# EAGLE design CrowPanel ESP32 Display-1.54(E) Inch(1) (EAGLE 9.6.2)
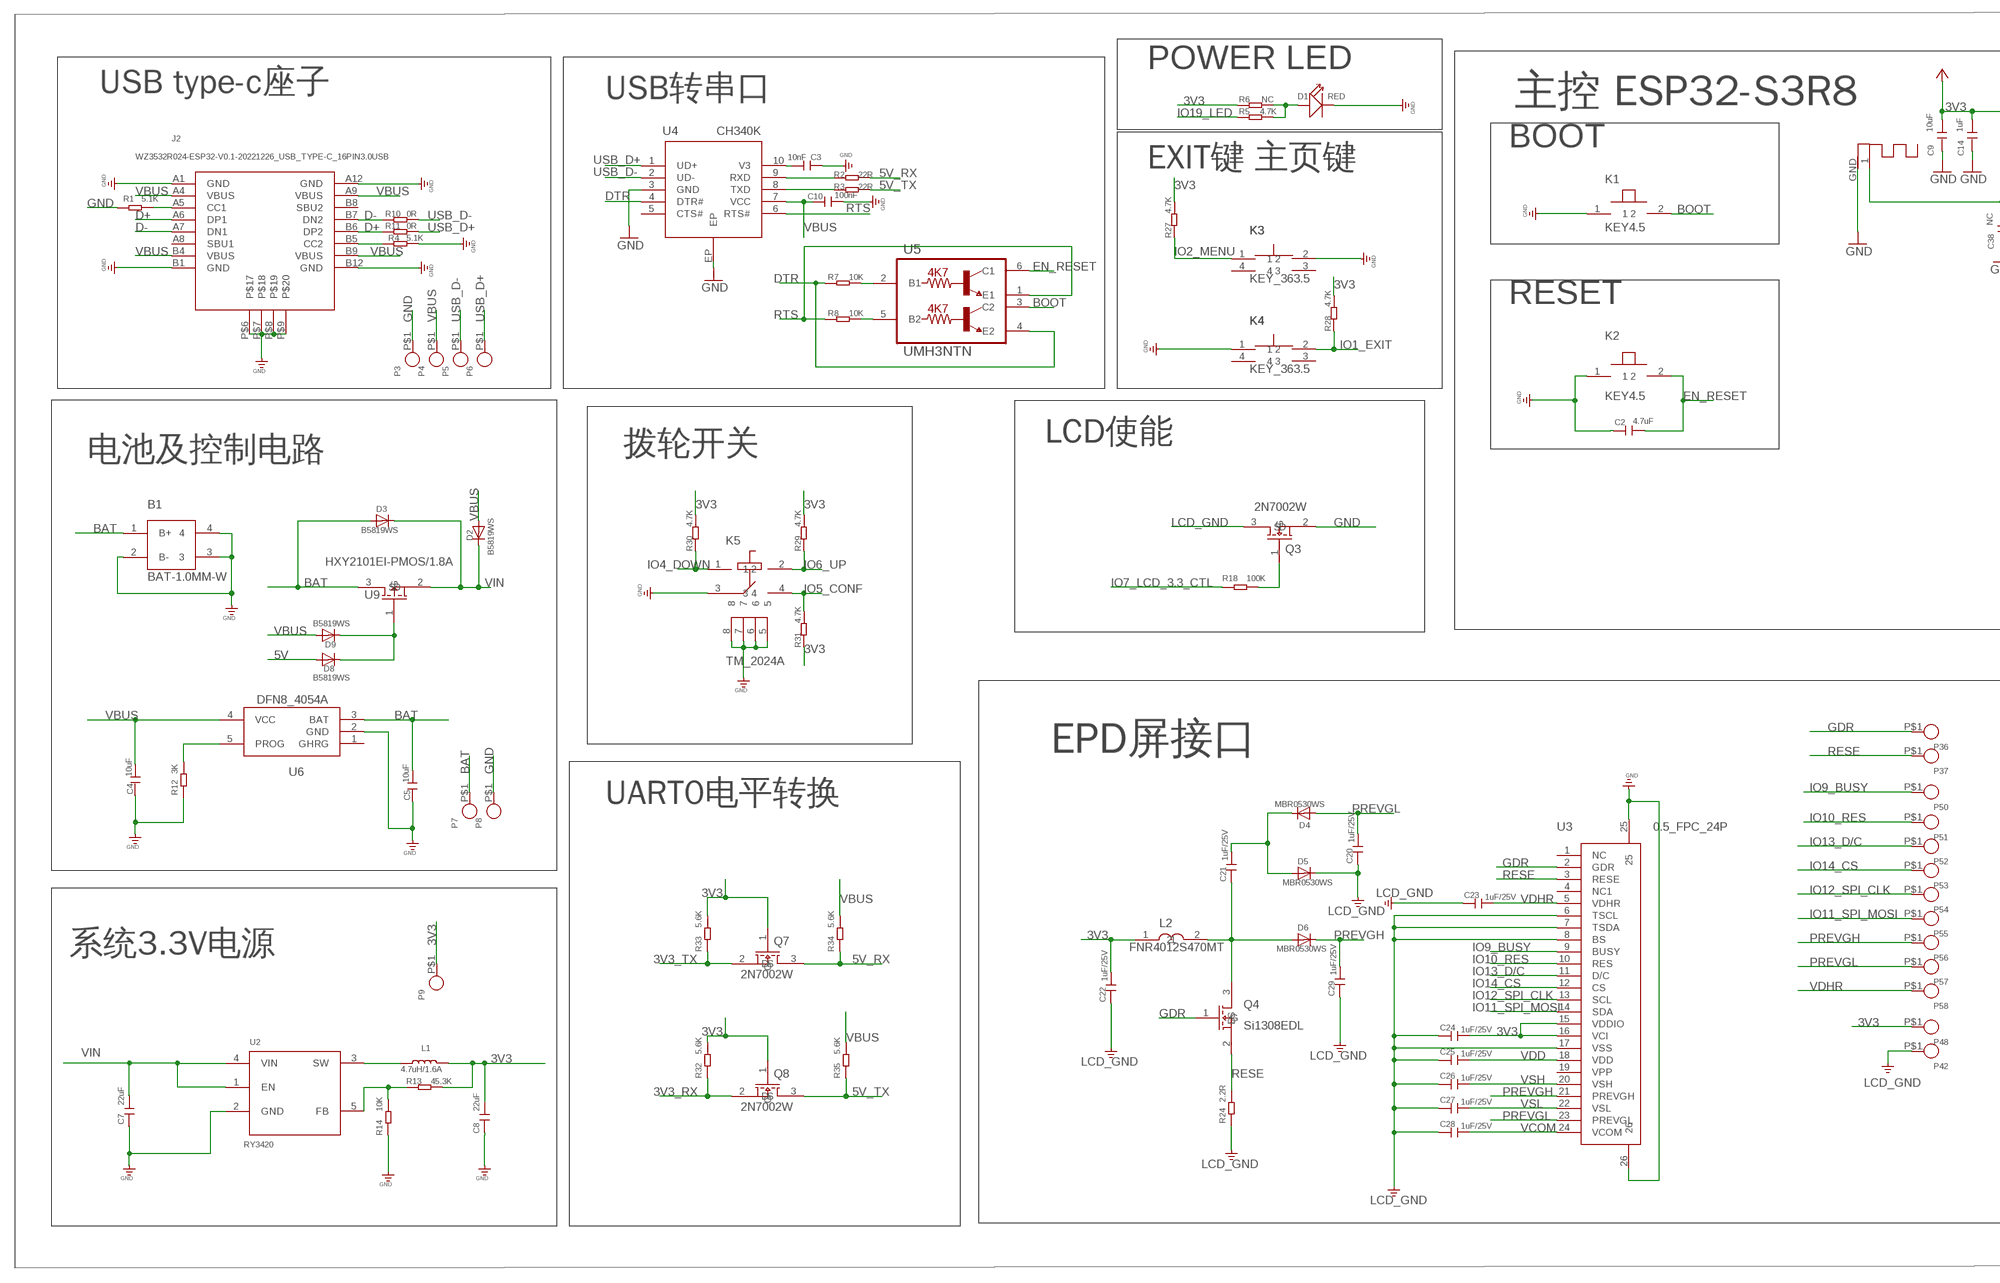
[diagram p0: schematic, sheet 1, part 1 of 2]
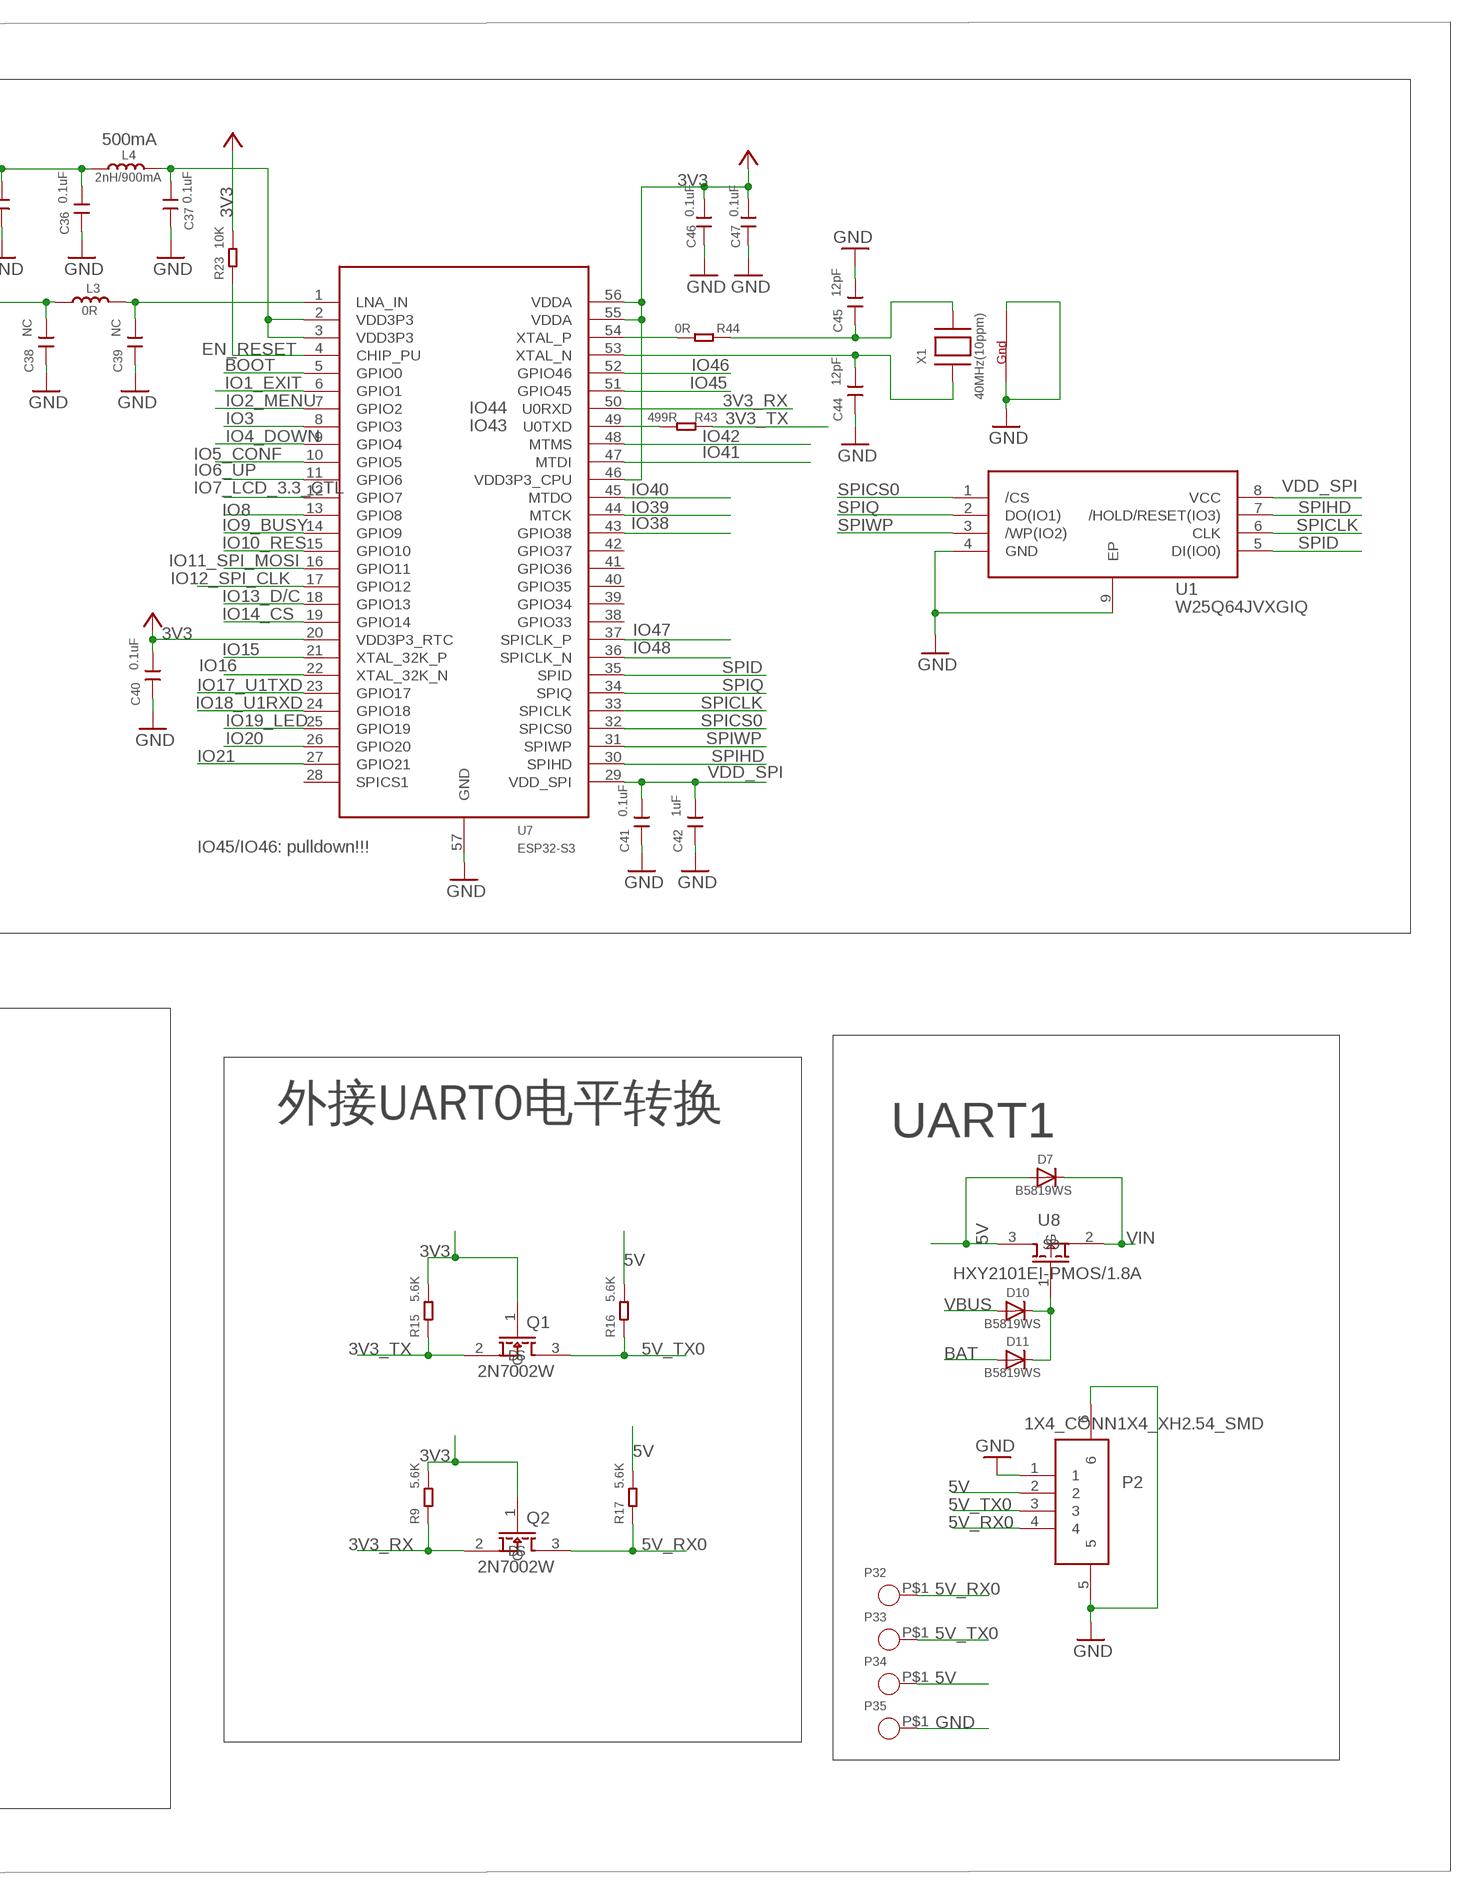
[diagram p1: schematic, sheet 1, part 2 of 2]

## Parts
ANT1  ADAFRUIT_ANTENNA  [ADAFRUIT_RN-ANT]
B1  BAT-1.0MM-W  [SH1.0MM-W]
C2  4.7uF  C0402_W  [0402]
C3  10nF  C0402_W  [0402]
C4  10uF  C0402_W  [0402]
C5  10uF  C0402_W  [0402]
C7  22uF  C0603  [0603]
C8  22uF  C0603  [0603]
C9  10uF  C0402_W  [0402]
C10  100nF  C0402_W  [0402]
C14  1uF  C0402_W  [0402]
C20  1uF/25V  C0402_W  [0402]
C21  1uF/25V  C0402_W  [0402]
C22  1uF/25V  C0402_W  [0402]
C23  1uF/25V  C0402_W  [0402]
C24  1uF/25V  C0402_W  [0402]
C25  1uF/25V  C0402_W  [0402]
C26  1uF/25V  C0402_W  [0402]
C27  1uF/25V  C0402_W  [0402]
C28  1uF/25V  C0402_W  [0402]
C29  1uF/25V  C0402_W  [0402]
C36  0.1uF  C0402_W  [0402]
C37  0.1uF  C0402_W  [0402]
C38  NC  C0402_W  [0402]
C39  NC  C0402_W  [0402]
C40  0.1uF  C0402_W  [0402]
C41  0.1uF  C0402_W  [0402]
C42  1uF  C0402_W  [0402]
C44  12pF  C0402_W  [0402]
C45  12pF  C0402_W  [0402]
C46  0.1uF  C0402_W  [0402]
C47  0.1uF  C0402_W  [0402]
D1  RED  A_XBJ_DISCRETE_LED0603  [A_XBJ_DISCRETE_LED-0603]
D2  B5819WS  [DISCRETE_SOD323]
D3  B5819WS  [DISCRETE_SOD323]
D4  MBR0530WS  B5819WS  [DISCRETE_SOD323]
D5  MBR0530WS  B5819WS  [DISCRETE_SOD323]
D6  MBR0530WS  B5819WS  [DISCRETE_SOD323]
D7  B5819WS  [DISCRETE_SOD323]
D8  B5819WS  [DISCRETE_SOD323]
D9  B5819WS  [DISCRETE_SOD323]
D10  B5819WS  [DISCRETE_SOD323]
D11  B5819WS  [DISCRETE_SOD323]
J2  WZ3532R024-ESP32-V0.1-20221226_USB_TYPE-C_16PIN3.0USB  [WZ3532R024-ESP32-V0.1-20221226_KEVIN_3.0TYPEC-SMD]
K1  KEY4.5  [KEY-4.5]
K2  KEY4.5  [KEY-4.5]
K3  KEY_363.5  [KEY_3*6*3.5]
K4  KEY_363.5  [KEY_3*6*3.5]
K5  TM_2024A  [TM_2024A]
L1  4.7uH/1.6A  A9G_DISCRETE_L0805  [A9G_DISCRETE_L0805]
L2  FNR4012S470MT  [FNR4012S470MT]
L3  0R  L0402  [L0402]
L4  2nH/900mA  L0402  [L0402]
P2  1X4_CONN1X4_XH2.54_SMD  [CONN-SMD-4P-P2.54]
P3  CROWPI_POW_PADPAD-1.0MM  [CROWPI_POW_PAD-1.0MM]
P4  CROWPI_POW_PADPAD-1.0MM  [CROWPI_POW_PAD-1.0MM]
P5  CROWPI_POW_PADPAD-1.0MM  [CROWPI_POW_PAD-1.0MM]
P6  CROWPI_POW_PADPAD-1.0MM  [CROWPI_POW_PAD-1.0MM]
P7  CROWPI_POW_PADPAD-1.0MM  [CROWPI_POW_PAD-1.0MM]
P8  CROWPI_POW_PADPAD-1.0MM  [CROWPI_POW_PAD-1.0MM]
P9  CROWPI_POW_PADPAD-1.0MM  [CROWPI_POW_PAD-1.0MM]
P32  CROWPI_POW_PADPAD-1.0MM  [CROWPI_POW_PAD-1.0MM]
P33  CROWPI_POW_PADPAD-1.0MM  [CROWPI_POW_PAD-1.0MM]
P34  CROWPI_POW_PADPAD-1.0MM  [CROWPI_POW_PAD-1.0MM]
P35  CROWPI_POW_PADPAD-1.0MM  [CROWPI_POW_PAD-1.0MM]
P36  CROWPI_POW_PADPAD-1.0MM  [CROWPI_POW_PAD-1.0MM]
P37  CROWPI_POW_PADPAD-1.0MM  [CROWPI_POW_PAD-1.0MM]
P42  CROWPI_POW_PADPAD-1.0MM  [CROWPI_POW_PAD-1.0MM]
P48  CROWPI_POW_PADPAD-1.0MM  [CROWPI_POW_PAD-1.0MM]
P50  CROWPI_POW_PADPAD-1.0MM  [CROWPI_POW_PAD-1.0MM]
P51  CROWPI_POW_PADPAD-1.0MM  [CROWPI_POW_PAD-1.0MM]
P52  CROWPI_POW_PADPAD-1.0MM  [CROWPI_POW_PAD-1.0MM]
P53  CROWPI_POW_PADPAD-1.0MM  [CROWPI_POW_PAD-1.0MM]
P54  CROWPI_POW_PADPAD-1.0MM  [CROWPI_POW_PAD-1.0MM]
P55  CROWPI_POW_PADPAD-1.0MM  [CROWPI_POW_PAD-1.0MM]
P56  CROWPI_POW_PADPAD-1.0MM  [CROWPI_POW_PAD-1.0MM]
P57  CROWPI_POW_PADPAD-1.0MM  [CROWPI_POW_PAD-1.0MM]
P58  CROWPI_POW_PADPAD-1.0MM  [CROWPI_POW_PAD-1.0MM]
Q1  2N7002W  [SOT-323_W]
Q2  2N7002W  [SOT-323_W]
Q3  2N7002W  [SOT-323_W]
Q4  Si1308EDL  HXY2102EI  [SOT-323_W]
Q7  2N7002W  [SOT-323_W]
Q8  2N7002W  [SOT-323_W]
R1  5.1K  R0402-1  [0402]
R2  22R  R0402-1  [0402]
R3  22R  R0402-1  [0402]
R4  5.1K  R0402-1  [0402]
R5  4.7K  R0402-1  [0402]
R6  NC  R0402-1  [0402]
R7  10K  R0402-1  [0402]
R8  10K  R0402-1  [0402]
R9  5.6K  R0402-1  [0402]
R10  0R  R0402-1  [0402]
R11  0R  R0402-1  [0402]
R12  3K  R0402-1  [0402]
R13  45.3K  R0402-1  [0402]
R14  10K  R0402-1  [0402]
R15  5.6K  R0402-1  [0402]
R16  5.6K  R0402-1  [0402]
R17  5.6K  R0402-1  [0402]
R18  100K  R0402-1  [0402]
R23  10K  R0402-1  [0402]
R24  2.2R  R0402-1  [0402]
R27  4.7K  R0402-1  [0402]
R28  4.7K  R0402-1  [0402]
R29  4.7K  R0402-1  [0402]
R30  4.7K  R0402-1  [0402]
R31  4.7K  R0402-1  [0402]
R32  5.6K  R0402-1  [0402]
R33  5.6K  R0402-1  [0402]
R34  5.6K  R0402-1  [0402]
R35  5.6K  R0402-1  [0402]
R43  499R  R0402-1  [0402]
R44  0R  R0402-1  [0402]
U1  W25Q64JVXGIQ  [XSON-EP(4×4)]
U2  RY3420  CROWBOT_-V1.0-20220525_A_XBJ_HM3420B  [CROWBOT_-V1.0-20220525_A_XBJ_SOT23-5]
U3  0.5_FPC_24P  [0.5_FPC_24P]
U4  CH340K  [ESOP-10-EP-150MIL]
U5  UMH3NTN  [SOP65P210X100-6N]
U6  DFN8_4054A  [DFN8_SOP23-5]
U7  ESP32-S3  [QFN56-7*7MM]
U8  HXY2101EI-PMOS/1.8A  HXY2101EI-PMOS  [SOT-323_W]
U9  HXY2101EI-PMOS/1.8A  HXY2101EI-PMOS  [SOT-323_W]
X1  40MHz(10ppm)  ADAFRUIT_XTAL-4-3225  [ADAFRUIT_NX3225]

## Nets
3V3: C8.2 C9.2 C14.2 C22.1 C24.1 C36.2 C40.2 C46.2 C47.2 L1.2 L2.1 L4.1 P9.P$1 P48.P$1 Q1.1(G) Q2.1(G) Q7.1(G) Q8.1(G) R6.2 R9.2 R13.2 R15.2 R23.2 R27.2 R28.2 R29.2 R30.2 R31.1 R32.2 R33.2 U3.15(VDDIO) U3.16(VCI) U7.20(VDD3P3_RTC) U7.46(VDD3P3_CPU) U7.55(VDDA) U7.56(VDDA) ; supply symbol labelled +3V3
3V3_RX: Q2.2(S) Q8.2(S) R9.1 R32.1 U7.50(U0RXD)
3V3_TX: Q1.2(S) Q7.2(S) R15.1 R33.1 R43.1
5V: D7.+(A) D8.+(A) P2.2 P34.P$1 R16.2 R17.2 U8.3(D)
5V_RX: Q7.3(D) R2.2 R34.1
5V_RX0: P2.4 P32.P$1 Q2.3(D) R17.1
5V_TX: Q8.3(D) R3.2 R35.1
5V_TX0: P2.3 P33.P$1 Q1.3(D) R16.1
BAT: B1.1(B+) C5.2 D3.+(A) D11.+(A) P7.P$1 U6.3(BAT) U9.3(D)
BOOT: K1.2 U5.3(C2) U7.5(GPIO0)
D+: J2.A6(DP1) J2.B6(DP2) R11.1
D-: J2.A7(DN1) J2.B7(DN2) R10.1
DTR: R7.1 U4.4(DTR#) U5.4(E2)
EN_RESET: C2.2 K2.2 R23.1 U5.6(C1) U7.4(CHIP_PU)
GDR: P36.P$1 Q4.1(G) U3.2(GDR)
GND: ANT1.GND B1.2(B-) B1.3 B1.4 C2.1 C3.1 C4.1 C5.1 C7.1 C8.1 C9.1 C10.2 C14.1 C36.1 C37.1 C38.1 C39.1 C40.1 C41.1 C42.1 C44.1 C45.2 C46.1 C47.1 D1.- J2.A1(GND) J2.A12(GND) J2.B1(GND) J2.B12(GND) J2.P$6 J2.P$7 J2.P$8 J2.P$9 K1.1 K2.1 K3.2 K4.1 K5.3 K5.5 K5.6 K5.7 K5.8 P2.1 P2.5 P2.6 P3.P$1 P8.P$1 P35.P$1 Q3.2(S) R1.1 R4.2 R12.1 R14.1 U1.4(GND) U1.9(EP) U2.2(GND) U3.25 U3.26 U4.3(GND) U4.EP U6.2(GND) U7.57(GND) X1.2(G2) X1.4(G1)
IO1_EXIT: K4.2 R28.1 U7.6(GPIO1)
IO2_MENU: K3.1 R27.1 U7.7(GPIO2)
IO3: U7.8(GPIO3)
IO4_DOWN: K5.1 R30.1 U7.9(GPIO4)
IO5_CONF: K5.4 R31.2 U7.10(GPIO5)
IO6_UP: K5.2 R29.1 U7.11(GPIO6)
IO7_LCD_3.3_CTL: R18.1 U7.12(GPIO7)
IO8: U7.13(GPIO8)
IO9_BUSY: P50.P$1 U3.9(BUSY) U7.14(GPIO9)
IO10_RES: P51.P$1 U3.10(RES) U7.15(GPIO10)
IO11_SPI_MOSI: P55.P$1 U3.14(SDA) U7.16(GPIO11)
IO12_SPI_CLK: P54.P$1 U3.13(SCL) U7.17(GPIO12)
IO13_D/C: P52.P$1 U3.11(D/C) U7.18(GPIO13)
IO14_CS: P53.P$1 U3.12(CS) U7.19(GPIO14)
IO15: U7.21(XTAL_32K_P)
IO16: U7.22(XTAL_32K_N)
IO17_U1TXD: U7.23(GPIO17)
IO18_U1RXD: U7.24(GPIO18)
IO19_LED: R5.2 U7.25(GPIO19)
IO20: U7.26(GPIO20)
IO21: U7.27(GPIO21)
IO38: U7.43(GPIO38)
IO39: U7.44(MTCK)
IO40: U7.45(MTDO)
IO41: U7.47(MTDI)
IO42: U7.48(MTMS)
IO45: U7.51(GPIO45)
IO46: U7.52(GPIO46)
IO47: U7.37(SPICLK_P)
IO48: U7.36(SPICLK_N)
LCD_GND: C20.2 C22.2 C23.2 C24.2 C25.2 C26.2 C27.2 C28.2 C29.2 D5.-(C) P42.P$1 Q3.3(D) R24.1 U3.6(TSCL) U3.7(TSDA) U3.8(BS) U3.17(VSS) ; supply symbol labelled GND
N$1: R7.2 U5.2(B1)
N$2: D10.-(C) D11.-(C) U8.1(G)
N$3: R8.2 U5.5(B2)
N$5: J2.A5(CC1) R1.2
N$6: D8.-(C) D9.-(C) U9.1(G)
N$7: Q3.1(G) R18.2
N$8: R3.1 U4.8(TXD)
N$9: R13.1 R14.2 U2.5(FB)
N$10: C3.2 U4.10(V3)
N$11: L1.1 U2.3(SW)
N$12: J2.B5(CC2) R4.1
N$16: R12.2 U6.5(PROG)
N$25: D1.+ R5.1 R6.1
N$30: ANT1.1(FEED) C38.2 L3.1
N$31: C39.2 L3.2 U7.1(LNA_IN)
N$33: C37.2 L4.2 U7.2(VDD3P3) U7.3(VDD3P3)
N$36: R2.1 U4.9(RXD)
N$37: R44.2 U7.54(XTAL_P)
N$55: C21.1 D4.-(C) D5.+(A)
N$56: C21.2 D6.+(A) L2.2 Q4.3(D)
N$63: R43.2 U7.49(U0TXD)
N$65: C44.2 U7.53(XTAL_N) X1.1(X1)
N$66: C45.1 R44.1 X1.3(X2)
PREVGH: C29.1 D6.-(C) P56.P$1 U3.21(PREVGH)
PREVGL: C20.1 D4.+(A) P57.P$1 U3.23(PREVGL)
RESE: P37.P$1 Q4.2(S) R24.2 U3.3(RESE)
RTS: R8.1 U4.6(RTS#) U5.1(E1)
SPICLK: U1.6(CLK) U7.33(SPICLK)
SPICS0: U1.1(/CS) U7.32(SPICS0)
SPID: U1.5(DI(IO0)) U7.35(SPID)
SPIHD: U1.7(/HOLD/RESET(IO3)) U7.30(SPIHD)
SPIQ: U1.2(DO(IO1)) U7.34(SPIQ)
SPIWP: U1.3(/WP(IO2)) U7.31(SPIWP)
USB_D+: P6.P$1 R11.2 U4.1(UD+)
USB_D-: P5.P$1 R10.2 U4.2(UD-)
VBUS: C4.2 C10.1 D2.+(A) D9.+(A) D10.+(A) J2.A4(VBUS) J2.A9(VBUS) J2.B4(VBUS) J2.B9(VBUS) P4.P$1 R34.2 R35.2 U4.7(VCC) U6.4(VCC)
VCOM: C28.1 U3.24(VCOM)
VDD: C25.1 U3.18(VDD)
VDD_SPI: C41.2 C42.2 U1.8(VCC) U7.29(VDD_SPI)
VDHR: C23.1 P58.P$1 U3.5(VDHR)
VIN: C7.2 D2.-(C) D3.-(C) D7.-(C) U2.1(EN) U2.4(VIN) U8.2(S) U9.2(S)
VSH: C26.1 U3.20(VSH)
VSL: C27.1 U3.22(VSL)
Unconnected: J2.A8(SBU1) J2.B8(SBU2) K3.3 K3.4 K4.3 K4.4 U3.1(NC) U3.4(NC1) U3.19(VPP) U4.5(CTS#) U6.1(GHRG) U7.28(SPICS1) U7.38(GPIO33) U7.39(GPIO34) U7.40(GPIO35) U7.41(GPIO36) U7.42(GPIO37)

## Notes on the sheet
- POWER LED
- USB type-c座子 | USB转串口 | 500mA
- 主控 ESP32-S3R8
- BOOT
- EXIT键 主页键
- IO44
- IO43
- RESET
- LCD使能
- 电池及控制电路 | 拨轮开关
- IO45/IO46: pulldown!!!
- EPD屏接口 | 外接UART0电平转换
- UART1
- UART0电平转换
- 系统3.3V电源

## Library data of the parts
ANT1 = ESP32-S3 4.2“ EINK V1.3:ADAFRUIT_ANTENNA
B1 = WGH:BAT-1.0MM-W
C2-C5 C9 C10 C14 C20-C29 C36-C42 C44-C47 = WGH:C0402_W
C7 C8 = WGH:C0603
D1 = CrowPanel ESP32 Display-4.3-inch-V2.1-20240314:A_XBJ_DISCRETE_LED*
D2-D11 = ESP32-S3 4.2“ EINK V1.3:B5819WS
J2 = CrowPanel ESP32 Display-4.3-inch-V2.1-20240314:WZ3532R024-ESP32-V0.1-20221226_USB_TYPE-C_16PIN
K1 K2 = WGH:KEY4.5
K3 K4 = WGH:KEY_3*6*3.5
K5 = WGH:TM_2024A
L1 = ESP32-S3 4.2“ EINK V1.3:A9G_DISCRETE_L*
L2 = WGH:FNR4012S470MT
L3 L4 = SX1302_Module:L*
P2 = Connecting_base:1X4_CONN
P3-P9 P32-P37 P42 P48 P50-P58 = ESP32 Terminal - 3.5 Inch_2.0:CROWPI_POW_PAD*
Q1-Q3 Q7 Q8 = WGH:2N7002W
Q4 = WGH:HXY2102EI
R1-R18 R23 R24 R27-R35 R43 R44 = WGH:R0402-1
U1 = ESP32-S3 4.2“ EINK V1.3:W25Q64JVXGIQ
U2 = CrowPanel ESP32 Display-4.3-inch-V2.1-20240314:CROWBOT_-V1.0-20220525_A_XBJ_HM3420B
U3 = ESP32 Terminal - 3.5 Inch_2.0:0.5_FPC_24P
U4 = sale:CH340K
U5 = UMH3NTN:UMH3NTN: Dual NPN BJT with 4.7K Base resistor Datasheet <https://fscdn.rohm.com/en/products/databook/datasheet/discrete/transistor/digital/umh3ntn-e.pdf> BUY NOW <https://www.digikey.ca/en/products/detail/rohm-semiconductor/umh3ntn/659279> Check availability <https://pricing.snapeda.com/parts/UMH3NTN/Rohm/view-part?ref=eda>; AVAILABILITY: In Stock; CHECK_PRICES: https://www.snapeda.com/parts/UMH3NTN/Rohm/view-part/?ref=eda; DESCRIPTION: Pre-Biased Bipolar Transistor (BJT) 2 NPN - Pre-Biased (Dual) 50V 100mA 250MHz 150mW Surface Mount UMT6; MF: Rohm; MP: UMH3NTN; PACKAGE: SOT-363 Rohm; PRICE: None; PURCHASE-URL: https://www.snapeda.com/api/url_track_click_mouser/?unipart_id=355768&manufacturer=Rohm&part_name=UMH3NTN&search_term=umh3n; SNAPEDA_LINK: https://www.snapeda.com/parts/UMH3NTN/Rohm/view-part/?ref=snap
U6 = CrowPanel ESP32 Display-4.3-inch-V2.1-20240314:DFN8_4054A
U7 = sale:ESP32-S3
U8 U9 = WGH:HXY2101EI-PMOS
X1 = ESP32-S3 4.2“ EINK V1.3:ADAFRUIT_XTAL-4: Classic 4-pin 3.2 x 2.5mm crystal

## Net classes
0 default: width 0.203 mm, drill 0.305 mm, clearance 0.152 mm

## Board
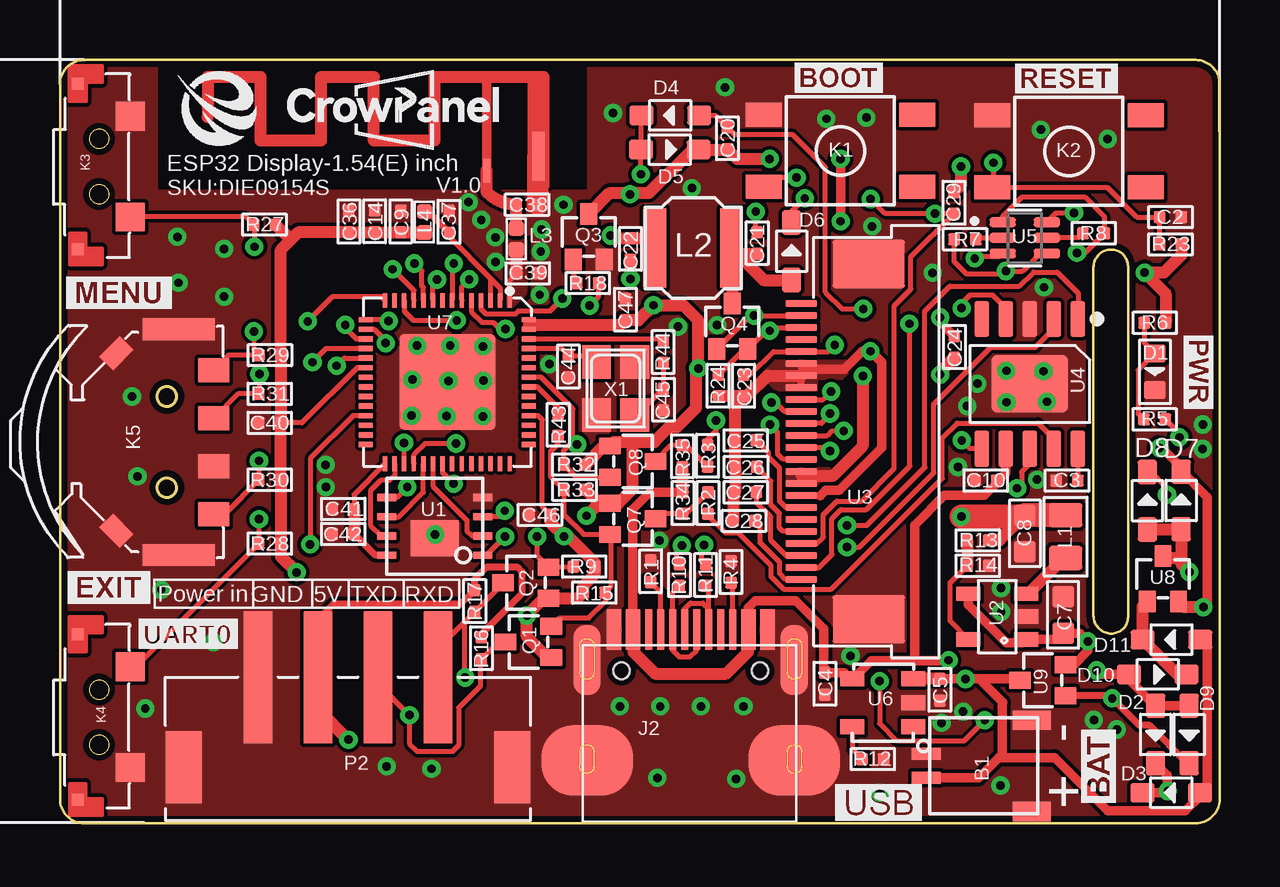
[diagram p2: board, top side]
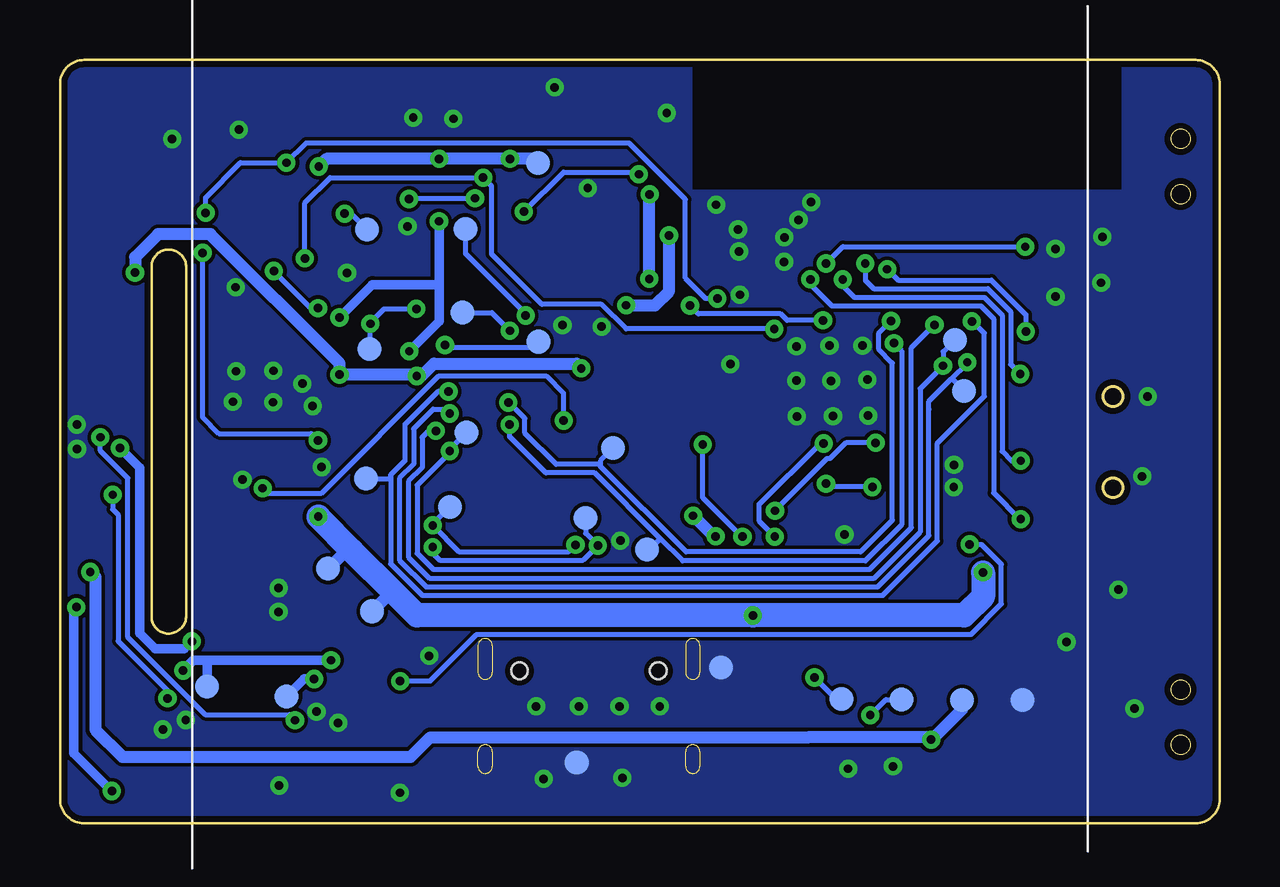
[diagram p3: board, bottom side, seen from below]

Size 48.32 x 31.8 mm. Coordinates in mm from the lower left corner, seen from the top.
Outline: 0,30.8 0,1 arc90 1,0 47.32,0 arc90 48.32,1 48.32,30.8 arc90 47.32,31.8 1,31.8 arc90 0,30.8
Outline: 43.81,7.9 arc90 44.5,8.59 44.5,23.2 arc90 43.8,23.9 arc90 43.06,23.16 43.06,8.65 arc90 43.81,7.9
Copper layers (1*16): Top 0.035mm / dielectric 1.5mm / Bottom 0.035mm
Design rules "default *": minimum track width 6mil, minimum drill 0.35mm, track to track 6mil, track to pad 6mil, pad to pad 6mil, via to via 6mil, smd to smd 6mil, copper to edge 10mil, drill to drill 6mil, minimum pad ring 10mil, minimum via ring 8mil, stop-mask expansion 4mil, vias tented up to drill 100mil, thermal gap 0mil
tRestrict: area 4.1,26.4 to 21.9,31.8
bRestrict: area 4.1,26.4 to 21.9,31.8

### Footprints (pad centres in the part's own frame; a part is rotated, then mirrored left to right if it is on the bottom)
ADAFRUIT_RN-ANT = smd 1 x 0.3: 1 0.5,2.159 | smd 2.032 x 0.508: GND 1.1,0
SH1.0MM-W = smd 0.5 x 1.2: 1 -0.5,2.4; 2 0.5,2.4 | smd 0.8 x 1.6: 3 -1.9,-2; 4 1.9,-2
0402 = smd 0.5 x 0.5: 1 -0.45,0; 2 0.45,0
0603 = smd 0.889 x 0.889: 1 -0.762,0; 2 0.762,0
A_XBJ_DISCRETE_LED-0603 = smd 0.762 x 0.889: + -0.762,0; - 0.762,0
DISCRETE_SOD323 = smd 1 x 0.8: + -1.2,0; - 1.2,0
WZ3532R024-ESP32-V0.1-20221226_KEVIN_3.0TYPEC-SMD = smd 0.3 x 1.7: A1 -3.35,0.5; A4 -2.55,0.5; A5 -1.25,0.5; A6 -0.25,0.5; A7 0.25,0.5; A8 1.25,0.5; A9 2.55,0.5; A12 3.35,0.5; B1 3.05,0.5; B4 2.25,0.5; B5 1.75,0.5; B6 0.75,0.5; B7 -0.75,0.5; B8 -1.75,0.5; B9 -2.25,0.5; B12 -3.05,0.5 | smd 1.143 x 2.921: P$6 -4.318,-0.762; P$7 4.318,-0.762 | smd 3.81 x 2.921: P$8 -4.318,-4.953; P$9 4.318,-4.953 | hole 0.68: -2.89,-1.22; 2.89,-1.22
KEY-4.5 = smd 1.5 x 1: 1 -3.2,1.5; 2 -3.2,-1.5; 3 3.2,-1.5; 4 3.2,1.5
KEY_3*6*3.5 = smd 1.2 x 1.2: 1 -2.1,-2.6; 2 2.1,-2.6 | smd 0.5 x 0.5: 3 3.45,-0.4; 4 -3.45,-0.4
TM_2024A = smd 1 x 1.3: 1 -3,0.65; 2 3,0.65; 3 -1,0.65; 4 1,0.65 | smd 0.9 x 3: 5 -4.7,2.1; 6 4.7,2.1 | smd 1.2 x 0.8 rotated 45: 7 -3.7,4.7 | smd 1.2 x 0.8 rotated 135: 8 3.7,4.7
A9G_DISCRETE_L0805 = smd 1.016 x 1.397: 1 -0.889,0; 2 0.889,0
FNR4012S470MT = smd 0.95 x 3.3: 1 -1.6,0; 2 1.6,0
L0402 = smd 0.635 x 0.635: 1 -0.445,0; 2 0.445,0
CONN-SMD-4P-P2.54 = smd 1.2 x 5.5: 1 -3.75,1.875; 2 -1.25,1.875; 3 1.25,1.875; 4 3.75,1.875 | smd 1.5 x 3: 5 6.85,-1.875; 6 -6.85,-1.875
CROWPI_POW_PAD-1.0MM = smd 1 x 1: P$1 0,0
SOT-323_W = smd 0.7 x 0.9: 1 -0.65,-0.95; 2 0.65,-0.95; 3 0,0.95
XSON-EP(4×4) = smd 0.8 x 0.3: 1 -2,1.2; 2 -2,0.4; 3 -2,-0.4; 4 -2,-1.2; 5 2,-1.2; 6 2,-0.4; 7 2,0.4; 8 2,1.2 | smd 2 x 1.5: 9 0,0.5
CROWBOT_-V1.0-20220525_A_XBJ_SOT23-5 = smd 0.6 x 1: 1 -0.95,-1.2; 2 0,-1.2; 3 0.95,-1.2; 4 0.95,1.2; 5 -0.95,1.2
0.5_FPC_24P = smd 1.3 x 0.3: 1 -2.54,5.75; 2 -2.54,5.25; 3 -2.54,4.75; 4 -2.54,4.25; 5 -2.54,3.75; 6 -2.54,3.25; 7 -2.54,2.75; 8 -2.54,2.25; 9 -2.54,1.75; 10 -2.54,1.25; 11 -2.54,0.75; 12 -2.54,0.25; 13 -2.54,-0.25; 14 -2.54,-0.75; 15 -2.54,-1.25; 16 -2.54,-1.75; 17 -2.54,-2.25; 18 -2.54,-2.75; 19 -2.54,-3.25; 20 -2.54,-3.75; 21 -2.54,-4.25; 22 -2.54,-4.75; 23 -2.54,-5.25; 24 -2.54,-5.75 | smd 3 x 2: 25 0.27,-7.4; 26 0.27,7.4
ESOP-10-EP-150MIL = smd 1.5 x 0.6: 1 -2.7,2; 2 -2.7,1; 3 -2.7,0; 4 -2.7,-1; 5 -2.7,-2; 6 2.7,-2; 7 2.7,-1; 8 2.7,0; 9 2.7,1; 10 2.7,2 | smd 2.4 x 3.2: EP 0,0
SOP65P210X100-6N = smd 1.09 x 0.4: 1 -0.92,0.65; 2 -0.92,0; 3 -0.92,-0.65; 4 0.92,-0.65; 5 0.92,0; 6 0.92,0.65
DFN8_SOP23-5 = smd 1 x 0.635: 1 -1.27,1; 2 -1.27,0; 3 -1.27,-1; 4 1.27,-1; 5 1.27,1
QFN56-7*7MM = smd 0.6 x 0.2: 1 -3.4,2.6; 2 -3.4,2.2; 3 -3.4,1.8; 4 -3.4,1.4; 5 -3.4,1; 6 -3.4,0.6; 7 -3.4,0.2; 8 -3.4,-0.2; 9 -3.4,-0.6; 10 -3.4,-1; 11 -3.4,-1.4; 12 -3.4,-1.8; 13 -3.4,-2.2; 14 -3.4,-2.6; 29 3.4,-2.6; 30 3.4,-2.2; 31 3.4,-1.8; 32 3.4,-1.4; 33 3.4,-1; 34 3.4,-0.6; 35 3.4,-0.2; 36 3.4,0.2; 37 3.4,0.6; 38 3.4,1; 39 3.4,1.4; 40 3.4,1.8; 41 3.4,2.2; 42 3.4,2.6 | smd 0.2 x 0.6: 15 -2.6,-3.4; 16 -2.2,-3.4; 17 -1.8,-3.4; 18 -1.4,-3.4; 19 -1,-3.4; 20 -0.6,-3.4; 21 -0.2,-3.4; 22 0.2,-3.4; 23 0.6,-3.4; 24 1,-3.4; 25 1.4,-3.4; 26 1.8,-3.4; 27 2.2,-3.4; 28 2.6,-3.4; 43 2.6,3.4; 44 2.2,3.4; 45 1.8,3.4; 46 1.4,3.4; 47 1,3.4; 48 0.6,3.4; 49 0.2,3.4; 50 -0.2,3.4; 51 -0.6,3.4; 52 -1,3.4; 53 -1.4,3.4; 54 -1.8,3.4; 55 -2.2,3.4; 56 -2.6,3.4 | smd 4 x 4: 57 0,0
ADAFRUIT_NX3225 = smd 1.4 x 1.2: 1 -1.1,-0.8; 2 1.1,-0.8; 3 1.1,0.8; 4 -1.1,0.8

### Placement (x,y rotation side)
ANT1  19.94,26.69 90 top
B1  38.49,2.39 90 top
C2  46.27,25.25 180 top
C3  41.96,14.28 0 top
C4  31.87,5.81 90 top
C5  36.66,5.56 90 top
C7  41.79,8.68 270 top
C8  40.2,12.08 90 top
C9  14.2,25.07 270 top
C10  38.58,14.28 180 top
C14  13.11,25.08 270 top
C20  27.81,28.54 270 top
C21  29.05,24.17 270 top
C22  23.77,23.93 270 top
C23  28.48,18.23 270 top
C24  37.27,19.84 90 top
C25  28.57,15.95 180 top
C26  28.58,14.85 180 top
C27  28.57,13.79 180 top
C28  28.5,12.6 180 top
C29  37.25,25.85 90 top
C36  12.04,25.07 270 top
C37  16.21,25.06 270 top
C38  19.46,25.77 180 top
C39  19.49,22.91 180 top
C40  8.74,16.68 0 top
C41  11.8,13.09 0 top
C42  11.8,12.05 0 top
C44  21.18,19.03 90 top
C45  25.14,17.65 270 top
C46  20,12.85 0 top
C47  23.56,21.4 270 top
D1  45.62,18.81 270 top
D2  45.65,3.7 270 top
D3  46.3,1.27 180 top
D4  25.43,29.49 180 top
D5  25.41,28.07 0 top
D6  30.48,23.83 90 top
D7  46.71,13.45 90 top
D8  45.31,13.44 90 top
D9  47.05,3.7 270 top
D10  45.74,6.2 0 top
D11  46.31,7.65 180 top
J2  26.28,7.57 0 top
K1  32.52,28.01 0 top
K2  42.04,27.99 0 top
K3  KEY_36*3.5  [KEY_3*6*3.5]  0.33,27.36 90 top
K4  KEY_36*3.5  [KEY_3*6*3.5]  0.33,4.42 90 top
K5  7.05,15.88 90 top
L1  41.9,11.94 90 top
L2  26.38,23.97 0 top
L3  19.01,24.34 270 top
L4  15.18,25.05 90 top
P2  12,4.21 0 top
P3  20.77,6.48 0 bottom
P4  42.19,5.69 0 bottom
P5  26.42,12.73 0 bottom
P6  32.08,13.18 0 bottom
P7  38.88,5.28 0 bottom
P8  26.79,2.52 0 bottom
P9  37.15,10.61 0 bottom
P32  15.76,5.17 0 bottom
P33  13.26,5.15 0 bottom
P34  10.73,5.13 0 bottom
P35  8.22,5.13 0 bottom
P36  31.43,24.77 0 bottom
P37  31.56,21.28 0 bottom
P42  28.41,27.52 0 bottom
P48  35.32,8.83 0 bottom
P50  35.57,14.36 0 bottom
P51  25.28,15.63 0 bottom
P52  10.65,18.01 0 bottom
P53  11.03,20.14 0 bottom
P54  31.38,16.28 0 bottom
P55  23.87,11.4 0 bottom
P56  35.53,24.74 0 bottom
P57  35.41,19.75 0 bottom
P58  28.39,20.06 0 bottom
Q1  19.52,7.55 90 top
Q2  19.41,10.02 90 top
Q3  22.03,24.43 0 top
Q4  28.01,20.7 0 top
Q7  23.87,12.68 270 top
Q8  23.87,15.07 270 top
R1  24.61,10.5 270 top
R2  27,13.34 90 top
R3  26.98,15.31 270 top
R4  27.96,10.47 90 top
R5  45.61,16.83 0 top
R6  45.62,20.85 0 top
R7  37.71,24.33 0 top
R8  43.07,24.58 180 top
R9  21.84,10.69 0 top
R10  25.81,10.34 90 top
R11  26.9,10.34 90 top
R12  33.87,2.67 180 top
R13  38.24,11.78 0 top
R14  38.24,10.73 180 top
R15  22.26,9.61 180 top
R16  17.56,7.29 90 top
R17  17.28,9.26 90 top
R18  21.99,22.5 180 top
R23  46.27,24.12 0 top
R24  27.42,18.23 90 top
R27  8.52,24.94 0 top
R28  8.74,11.65 0 top
R29  8.75,19.5 0 top
R30  8.74,14.31 0 top
R31  8.74,17.89 180 top
R32  21.43,14.94 0 top
R33  21.44,13.89 0 top
R34  25.95,13.34 90 top
R35  25.93,15.29 270 top
R43  20.76,16.6 90 top
R44  25.13,19.63 90 top
U1  15.61,12.37 180 top
U2  39.05,8.61 90 top
U3  33.43,15.9 0 top
U4  40.41,18.3 270 top
U5  40.2,24.39 0 top
U6  34.28,5.02 180 top
U7  16.14,18.38 270 top
U8  45.96,10.18 0 top
U9  40.95,5.96 90 top
U$6  [LOGO-MIN]  10.46,28.21 0 top
X1  23.15,18.11 270 top

### Tracks (layer width: path | path; a pad name or v marks a point on that pad's centre or on a via)
3V3  (via drill 0.35)
  Top 0.203: 19.54,20.75 U7.55 U7.56 | U3.15 30.89,14.63 30.89,14.48 U3.16 | U7.20 12.38,18.98 10.08,16.68 C40.2 | U7.46 19.92,16.98 20.1,16.8 20.1,13.18 20.43,12.85 C46.2 | v21,11.95 21.18,11.95
  Top 0.5: C8.2 39.14,11.78 R13.2 | v9.86,10.45 9.2,11.11 R28.2 R30.2 C40.2 R31.1 R29.2 9.2,23.89 9.61,24.3 | 9.61,24.3 R27.2 | 9.61,24.3 9.93,24.62 C36.2 C14.2 C9.2 14.88,24.62 14.93,24.57 15.14,24.57 L4.1 | 22.46,13.33 v21.94,12.81 | 22.46,13.33 Q7.1 23.27,13.33 23.87,13.93 23.87,15.89 | 22.46,13.33 R33.2 | 19.54,20.75 23.36,20.75 C47.2 24.1,20.95 v24.73,21.58 25.97,21.58 26.58,20.97 26.58,18.97 v26.6,18.95 26.49,18.84 26.49,17.3 25.71,16.52 25.39,16.52 24.76,15.89 23.87,15.89 | v22.94,24.48 23.05,24.38 C22.1 24.37,24.38 L2.1 | R6.2 46.07,22.06 v45.19,22.94 45.99,22.94 46.72,23.67 R23.2 | R32.2 22.66,15.72 Q8.1 23.09,15.89 23.87,15.89 | v33.45,18.64 33.45,18.62 33.45,15.71 32.22,14.48 30.89,14.48 | v36.67,18.69 36.67,18.79 C24.1 | 21.18,11.95 22.29,10.84 R9.2 22.28,10.37 21.81,9.9 R15.2 21.57,9.37 Q2.1 20.16,9.37 v19.45,8.66 19.45,7.77 20.32,6.9 Q1.1 | v21,11.95 20.45,12.5 C46.2
  Top 1: L1.2 40.21,12.83 C8.2 40.13,12.78 v37.56,12.78
  Bottom 0.5: v21,11.95 21.08,11.95 v21.94,12.81 | v24.73,21.58 23.53,21.58 22.94,22.17 v22.94,24.48 | v45.19,22.94 45.19,23.59 44.23,24.55 42.05,24.55 36.67,19.16 v36.67,18.69 33.51,18.69 v33.45,18.64 33.25,18.64 32.74,19.14 26.8,19.14 v26.6,18.95 | P9.P$1 36.4,11.36 36.16,11.36 | P48.P$1 34.48,9.67 34.46,9.67
  Bottom 1: v9.86,10.45 9.86,9.44 10.65,8.66 v19.45,8.66 33.45,8.66 34.46,9.67 36.16,11.36 37.56,12.76 v37.56,12.78
  pour Top: 30.25,14.8 30.25,14.05 31.5,14.05 31.7,14.25 32.26,14.25 32.43,14.42 32.06,14.79 31.41,14.79 30.26,14.79
3V3_RX  (via drill 0.35)
  Top 0.203: Q8.2 21.5,14.42 R32.1 20.98,15.53 21.37,15.92 | U7.50 20.06,18.57 21.37,17.26 21.37,15.92 | R9.1 21.37,10.67 Q2.2 19.88,11.15 v19.88,11.94 | v21.54,15.78 21.52,15.78 21.37,15.92
  Bottom 0.203: v19.88,11.94 19.92,11.94 21.54,13.56 v21.54,15.78
3V3_TX
  Top 0.203: R43.1 20.76,15.81 20.46,15.51 20.46,14.42 R33.1 20.99,12.86 21.82,12.03 Q7.2 22.94,12.01 22.94,9.84 R15.1 | Q1.2 20.83,8.56 22.04,8.56 22.71,9.23 R15.1 | R15.1
5V  (via drill 0.35)
  Top 0.3: P2.2 10.75,8.5 11.4,9.15 16.13,9.15 16.14,9.14 16.71,9.14 R17.2 17.28,10.18 17.78,10.68 19.05,10.68 19.24,10.48 19.24,9.56 17.56,7.88 R16.2
  Top 0.5: D8.+ 46.7,12.24 D7.+ 46.73,12.23 46.73,11.07 | v12.02,3.48 10.75,4.75 P2.2 | 46.73,11.07 46.02,11.07 U8.3 | v47.06,10.46 46.73,10.79 46.73,11.07
  Bottom 0.203: 17.16,3.58 17.24,3.58
  Bottom 0.5: 17.24,3.58 32.89,3.58 33.71,2.76 45.71,2.76 46.85,3.9 46.85,10.26 v47.06,10.46 | 12.12,3.58 17.16,3.58 | 12.12,3.58 11.9,3.58 10.73,4.75 P34.P$1 | 12.12,3.58 v12.02,3.48
5V_RX
  Top 0.203: R2.2 26.1,12.89 R34.1 25.03,12.89 Q7.3
5V_RX0  (via drill 0.35)
  Top 0.203: Q2.3 18.46,9.99 R17.1 16.86,8.38 | v16.88,6.07 16.86,6.09 16.86,8.38 | 16.86,8.38 15.75,7.28 P2.4
  Bottom 0.203: P32.P$1 15.98,5.17 v16.88,6.07
5V_TX
  Top 0.203: R3.2 26.1,15.74 R35.1 25.43,15.74 24.82,15.13 Q8.3
5V_TX0  (via drill 0.35)
  Top 0.203: Q1.3 18.27,7.55 R16.1 17.51,6.79 17.51,5.71 16.61,4.81 16.61,3.24 16.37,2.99 14.88,2.99 14.56,3.32 v14.56,4.5 13.25,5.81 P2.3
  Bottom 0.203: v14.56,4.5 13.91,5.15 P33.P$1
BAT  (via drill 0.35)
  Top 0.4: C5.2 v37.73,6.01 38.3,6.01 38.31,6.01 | B1.1 38.28,1.89 39.12,2.73 | 39.12,2.73 39.27,2.88 39.27,5.04 38.31,6.01 | D11.+ 47.8,7.36 47.8,1.56 47.52,1.27 D3.+ 47.5,1.13 46.88,0.52 43.66,0.52 41.44,2.73 39.12,2.73 | U9.3 39.94,6.01 38.31,6.01
  Top 0.5: C5.2 U6.3
  Bottom 0.4: P7.P$1 38.86,5.28 38.13,6.01 v37.73,6.01
BOOT  (via drill 0.35)
  Top 0.203: U5.3 39.15,23.61 38.19,23.61 v38.12,23.53 | v30.69,26.9 29.71,26.9 K1.2 | v18.56,20.59 18.33,20.59 18.05,20.87 17.59,20.87 17.14,21.32 U7.5
  Bottom 0.203: v38.12,23.53 38.12,25.84 37.06,26.9 v30.69,26.9 30.33,26.54 30.33,23.71 28.24,21.62 25.76,21.62 24.73,20.59 v18.56,20.59
D+
  Top 0.203: J2.A6 26.03,8.94 26.27,9.17 26.79,9.17 27.03,8.93 J2.B6 27.03,9.76 R11.1
D-
  Top 0.203: J2.A7 26.53,7.21 26.25,6.93 25.8,6.93 25.53,7.2 J2.B7 25.53,9.61 R10.1
DTR  (via drill 0.35)
  Top 0.203: U5.4 40.84,23.74 40.11,23.01 v39.41,23.01 39.29,22.89 37.77,22.89 37.26,23.39 R7.1 | U4.4 39.41,21.46 38.86,22.01 37.91,22.01 37.57,21.67 v37.57,21.46
  Bottom 0.203: v39.41,23.01 37.72,21.31 v37.57,21.46
EN_RESET  (via drill 0.35)
  Top 0.203: v38.89,27.52 38.89,26.54 K2.2 43.63,26.49 44.87,25.25 C2.2 R23.1 | U5.6 41.51,25.43 v42.25,25.43 | U7.4 17.54,21.43 17.74,21.23 18.97,21.23 19.08,21.34 20.41,21.34 v20.93,21.86
  Bottom 0.203: v20.93,21.86 21.41,21.86 22.26,22.71 22.26,26 24.61,28.34 38.07,28.34 v38.89,27.52 40.8,27.52 42.25,26.07 v42.25,25.43
GDR  (via drill 0.35)
  Top 0.203: Q4.1 28.76,21.15 v28.92,21.15 U3.2
  Bottom 0.203: P36.P$1 31.43,23.74 28.92,21.23 v28.92,21.15
GND  (via drill 0.35)
  Top 0.9: C38.1 19.91,27.76 ANT1.GND
  other vias: 6.84,23.93 6.84,21.94 11.08,14 15.63,12.03 14.88,19.9 16.26,19.9 17.63,19.87 14.68,18.48 14.65,16.98 16.11,16.96 16.19,18.43 17.62,16.95 17.64,18.44 39.43,18.85 39.44,17.54 41.12,17.56 17.02,25.88 17.55,25.14 18.14,24.41 18.15,23.39 19.99,22.02 20.03,23.82 20.07,24.74 20.98,25.77 24.97,11.77 39.21,9.8 39.22,8.8 43.08,4.3 40.71,14.31 37.42,14.84 32.94,6.97 25.75,20.69 27.38,20.75 26.33,26.46 20.39,19.13 25.01,4.87 28.48,4.87 36.73,4.18 37.63,4.65 41,22.33 11.07,14.93 40.98,18.83 4.89,24.43 4.94,22.52 3,17.78 3.23,14.45 4.22,9.73 6.38,7.55 3.55,4.78 13.61,2.37 15.48,2.27 24.89,1.89 28.17,1.85 34.16,1.27 39.19,1.57 47.62,16.61 47.61,15.59 23.04,29.59 27.71,30.66 31.93,29.35 33.6,29.4 40.87,28.9 43.65,28.51 38.22,18.32 37.8,17.38 33.84,24.87 36.36,22.93 23.33,4.87 26.7,4.87 44.03,3.9
  pour Top (rank 2): -1.96,32.84 -1.96,-0.76 -1.95,-0.77 48.92,-0.77 48.93,-0.78 48.93,32.93 48.92,32.94 21.96,32.94 21.96,26.4 4.13,26.4 4.1,26.37 4.1,32.9 4.14,32.94 -1.86,32.94
  pour Bottom (rank 2): -1.96,33.46 -1.96,-0.8 -1.97,-0.81 48.9,-0.81 48.93,-0.78 48.93,32.89 48.89,32.93 21.96,32.93 21.96,26.4 4.1,26.4 4.1,32.95 -1.45,32.95
IO1_EXIT  (via drill 0.35)
  Top 0.203: U7.6 16.74,22.34 v17.05,22.66 | v8.29,12.67 R28.1 3.16,6.52 K4.2
  Bottom 0.203: v17.05,22.66 17.05,22.46 16.15,21.56 9.96,21.56 9.42,21.02 9.42,13.76 8.33,12.67 v8.29,12.67
IO2_MENU  (via drill 0.35)
  Top 0.203: v16.41,23.32 16.34,23.25 U7.7 | v8.1,24.02 8.1,24.91 R27.1 7.75,25.26 K3.1
  Bottom 0.203: v16.41,23.32 15.71,24.02 v8.1,24.02
IO4_DOWN  (via drill 0.35)
  Top 0.203: U7.9 15.54,22.49 v15.71,22.66 | v8.29,15.1 R30.1 6.86,12.88 K5.1
  Bottom 0.203: v15.71,22.66 15.71,22.4 15.22,21.91 9.81,21.91 9.06,21.17 9.06,15.49 8.67,15.1 v8.29,15.1
IO5_CONF  (via drill 0.35)
  Top 0.203: v8.31,18.72 8.31,17.91 R31.2 7.41,17.89 K5.4 | U7.10 15.14,22.33 15.07,22.39 15.07,23.01 v14.77,23.32
  Bottom 0.203: v14.77,23.32 14.77,22.62 14.42,22.27 9.66,22.27 8.71,21.32 8.71,19.12 v8.31,18.72
IO6_UP  (via drill 0.35)
  Top 0.203: U7.11 14.74,22.2 v13.86,23.08 | v8.08,20.49 v8.07,20.48 8.07,19.73 R29.1 7.02,19.5 K5.2
  Bottom 0.203: v13.86,23.08 13.4,22.63 9.51,22.63 8.07,21.19 v8.07,20.49 v8.08,20.49
IO7_LCD_3.3_CTL  (via drill 0.35)
  Top 0.203: U7.12 14.35,21.33 14.73,20.95 v16.53,20.95 | v22.07,21.57 22.44,21.94 R18.1
  Bottom 0.203: v16.53,20.95 18.02,20.95 18.3,21.23 21.73,21.23 v22.07,21.57
IO9_BUSY  (via drill 0.35)
  Top 0.203: v10.32,20.91 11.35,21.94 13.38,21.94 U7.14 | U3.9 31.79,17.65 v32.13,17.99
  Bottom 0.203: 34.54,14.42 34.54,14.51 33.95,15.1 33.95,16.6 32.56,17.99 v32.13,17.99 | 34.54,14.42 34.54,10.81 33.22,9.49 14.03,9.49 11.76,11.76 11.76,15.83 9.81,17.78 9.81,20.42 10.3,20.91 v10.32,20.91 | P50.P$1 34.6,14.36 34.54,14.42
IO10_RES  (via drill 0.35)
  Top 0.203: U3.10 30.88,17.16 30.18,17.16 29.81,17.53 v29.64,17.53 | U7.15 13.65,20.97 v13.69,20.93
  Bottom 0.203: v13.69,20.93 v13.7,20.93 14.2,20.42 14.2,19.74 13.63,19.17 13.63,12.63 14.96,11.31 22.23,11.31 25.8,14.88 | 25.8,14.88 25.88,14.96 27.65,14.96 28.95,16.26 28.95,16.87 29.61,17.53 v29.64,17.53 | P51.P$1 25.8,15.1 25.8,14.88
IO11_SPI_MOSI  (via drill 0.35)
  Top 0.203: U3.14 30.87,15.17 30.12,15.17 29.89,15.4 29.89,16.3 v29.58,16.61 | v13.57,20 13.57,20.1 13.09,20.58 U7.16
  Bottom 0.203: v13.57,20 13.25,19.68 13.25,12.44 14.76,10.94 22.38,10.94 23.3,11.86 | v29.58,16.61 29.58,16.1 28.08,14.6 26.04,14.6 23.3,11.86 | P55.P$1 23.76,11.4 23.3,11.86
IO12_SPI_CLK  (via drill 0.35)
  Top 0.203: v32.08,15.51 31.94,15.65 U3.13 | v11.88,20.77 11.88,20.64 12.34,20.18 U7.17
  Bottom 0.203: v11.88,20.77 11.89,20.77 12.85,19.81 12.85,12.31 14.59,10.57 32.77,10.57 33.44,11.24 33.44,14.09 32.08,15.44 v32.08,15.51 32.08,15.58 P54.P$1
IO13_D/C  (via drill 0.35)
  Top 0.203: U3.11 31.72,16.66 32.08,17.02 v32.08,17.07 | v10.52,19.21 11.09,19.78 U7.18
  Bottom 0.203: v32.08,17.07 32.26,17.25 32.77,17.25 33.59,16.43 33.59,14.96 34.18,14.37 34.18,10.96 33.07,9.85 14.25,9.85 12.11,11.99 12.11,17.24 12.12,17.25 12.12,17.58 11.27,18.43 11.18,18.51 | v10.52,19.21 10.52,19.17 11.18,18.51 | P52.P$1 11.15,18.51 11.18,18.51
IO14_CS  (via drill 0.35)
  Top 0.203: U3.12 31.96,16.15 32.16,16.35 v32.66,16.35 | v11.53,19.06 11.85,19.38 U7.19
  Bottom 0.203: v32.66,16.35 32.96,16.35 33.23,16.07 33.23,14.81 33.8,14.24 33.8,11.09 32.93,10.21 14.39,10.21 12.48,12.13 12.48,18.11 v11.53,19.06 11.53,19.64 P53.P$1
IO19_LED  (via drill 0.35)
  Top 0.203: U7.25 12.21,16.98 10.43,15.2 v10.43,11.63 v10.42,11.62 | v46.64,16.08 46.64,16.25 R5.2 | v34.15,5.92 34.15,4.16 34.9,3.42 37.66,3.42 v38.53,4.29
  Bottom 0.203: v46.64,16.08 46.64,15.53 45.49,14.38 45.49,7.74 42.27,4.52 38.76,4.52 v38.53,4.29 | v34.15,5.92 32.91,5.92 30.97,7.86 10.38,7.86 9.1,9.14 9.1,10.78 9.93,11.62 v10.42,11.62
LCD_GND  (via drill 0.35)
  Top 0.203: U3.17 31.68,13.65 | 23.74,26.26 23.75,26.25 v23.75,26.2
  Top 0.3: U3.8 U3.7 U3.6
  Top 0.4: 31.68,13.65 31.91,13.88 32.46,13.88 34.24,15.65 34.24,19.2 v33.77,19.67 33.42,19.67 32.67,18.91 31.15,18.91 U3.7 | v32.53,25.08 v32.53,27.67 v32.52,27.68 | C24.2 36.67,20.89 v36.67,21.07
  Top 0.5: C23.2 R24.1 | C23.2 28.12,17.42 C25.2 C26.2 C27.2 28.05,13.72 C28.2 | C23.2 28.61,17.78 29.48,18.65 U3.7 | Q3.3 22.91,26.26 23.74,26.26 24.52,26.26 26.33,28.07 D5.- 27.79,28.07 C20.2 28.22,27.68 v29.57,27.68 | C22.2 v23.77,22.68 | v37.54,27.36 37.54,26.59 C29.2
  Bottom 0.203: v23.75,26.2 23.77,26.22
  Bottom 0.4: v33.77,19.67 32.53,20.91 32.53,22.44 | 32.53,22.44 v32.53,25.08 | v36.67,21.07 35.3,22.44 32.53,22.44
  Bottom 0.5: v23.77,22.68 23.77,26.22 | v37.54,27.36 37.22,27.68 v32.52,27.68 v29.57,27.68 28.58,27.68 P42.P$1
  pour Top: 29.45,18.91 29.8,19.26 30.37,19.26 32.79,19.26 32.8,19.25 32.8,18.73 32.59,18.52 31.64,18.52 31.54,18.42 31.54,18.03 29.83,18.03 29.47,18.39 29.47,18.89
N$1
  Top 0.203: R7.2 38.22,24.39 U5.2
N$2
  Top 0.5: U8.1 45.11,9.04 D11.- 46.56,6.2 D10.-
N$3
  Top 0.203: R8.2 42.44,24.4 U5.5
N$5
  Top 0.203: J2.A5 25.03,9.63 R1.2
N$6  (via drill 0.35)
  Top 0.203: v46.12,13.68 46.12,13.97 45.46,14.64 D8.-
  Top 0.3: D9.- 46.98,2.5 45.4,4.08 44.97,4.08 v43.84,5.2 43.74,5.31 U9.1
  Bottom 0.203: v46.12,13.68 46.12,13.08 45.9,12.85 45.9,7.59 43.84,5.54 v43.84,5.2
N$7
  Top 0.203: R18.2 21.4,22.64 21.4,23.46 Q3.1
N$8  (via drill 0.35)
  Top 0.203: v27.33,16.78 27.33,16.35 26.98,16 R3.1 | U4.8 40.41,14.98 40.07,14.64 40.07,14.15 v39.88,13.95
  Bottom 0.203: v27.33,16.78 27.33,17.9 28.07,18.64 32.54,18.64 37.42,13.75 39.67,13.75 v39.88,13.95
N$9
  Top 0.203: U2.5 37.09,8.43 37.09,10.02 R14.2
  Top 0.5: R13.1 R14.2
N$10
  Top 0.203: U4.10 C3.2
N$11
  Top 0.5: U2.3 40.34,9.56 41.83,11.05 L1.1
N$12
  Top 0.203: J2.B5 28.03,9.95 R4.1
N$16
  Top 0.203: U6.5 33.01,3.08 R12.2
N$25
  Top 0.203: R6.1 45.17,20.02 D1.+ 44.92,18.87 44.92,17.07 R5.1
N$30
  Top 0.5: L3.1 C38.2 arc-45 17.82,26.26 17.79,26.29 arc-45 17.78,26.32 ANT1.1
N$31
  Top 0.203: U7.1 18.74,22.61 C39.2
  Top 0.5: C39.2 19.04,23.87 L3.2
  pour Top: 18.63,24.29 18.63,21.52 18.89,21.52 19.43,22.06 19.43,24.29
N$33
  Top 0.203: C37.2 16.21,24.43 17.89,22.75 17.94,22.7 | U7.2 18.34,22.3 17.94,22.7 | U7.3 17.94,22.7
  Top 0.3: L4.2 15.32,25.49 C37.2
N$36
  Top 0.203: R2.1 27.04,12.89 27.04,12.78 27.73,12.09 28.28,12.09 29.63,10.73 29.63,10.27 30.15,9.75 32.14,9.75 36.77,14.37 36.77,16.05 37.38,16.67 40.76,16.67 41.32,16.1 41.32,15.69 U4.9
N$37
  Top 0.203: U7.54 25.03,20.18 R44.2
N$55  (via drill 0.35)
  Top 0.203: C21.1 28.99,24.68 v28.99,25.48 | v24.2,27.04 D5.+ 24.21,29.47 D4.-
  Bottom 0.203: v28.99,25.48 27.34,27.13 24.29,27.13 v24.2,27.04
N$56
  Top 0.5: L2.2 28.23,23.72 C21.2 | L2.2 28.01,23.94 Q4.3 | L2.2 29.32,22.63 D6.+
N$63
  Top 0.203: R43.2 20.76,17.31 19.89,18.18 U7.49
N$65
  Top 0.203: U7.53 20.88,19.78 C44.2 22.08,19.48 X1.1
N$66
  Top 0.203: R44.1 C45.1 24.05,17.01 X1.3
PREVGH  (via drill 0.35)
  Top 0.203: U3.21 30.9,11.64 31.52,11.64 31.8,11.92 31.8,12.85 32.37,13.42 33.4,13.42 34.76,14.78 34.76,21.56 35.45,22.25 35.45,23.6 C29.1 v36.46,25.4 34.39,25.4 v33.78,26.01 | v31.03,26.04 30.48,25.49 D6.-
  Bottom 0.203: v33.78,26.01 33.75,26.04 v31.03,26.04 | P56.P$1 36.19,25.4 v36.46,25.4
PREVGL  (via drill 0.35)
  Top 0.203: D4.+ 27.31,29.49 C20.1 28.11,28.69 30.53,28.69 31.89,27.32 31.89,22.13 32.59,21.43 v33.47,21.43 | U3.23 31.62,10.65 32.16,11.19 32.16,12.68 32.54,13.06 33.59,13.06 35.41,14.88 35.41,20.79 v35.39,20.81
  Bottom 0.203: v33.47,21.43 34.81,21.43 35.41,20.83 v35.39,20.81 35.39,19.78 P57.P$1
RESE  (via drill 0.35)
  Top 0.203: 29.56,20.65 Q4.2 28.52,19.75 27.45,18.68 R24.2 | 29.56,20.65 U3.3 | v29.57,20.52 v29.56,20.53 29.56,20.65
  Bottom 0.203: P37.P$1 31.55,21.27 30.32,21.27 v29.57,20.52
RTS  (via drill 0.35)
  Top 0.203: U5.1 39.28,25.29 40.07,26.07 42.72,26.07 43.52,25.28 R8.1 43.52,24.57 42.72,23.77 v42.38,23.77 | U4.6 37.92,15.6 v37.57,15.95
  Bottom 0.203: v37.57,15.95 37.86,16.24 41.7,16.24 42.38,16.92 v42.38,23.77
SPICLK
  Top 0.203: U1.6 14.13,12.78 15.14,13.79 U7.33
SPICS0  (via drill 0.35)
  Top 0.203: v16.5,15.82 15.21,15.82 14.74,15.35 U7.32 | U1.1 17.77,11.17 v18.54,11.94
  Bottom 0.203: v16.5,15.82 16.65,15.82 19.2,13.27 19.2,12.6 v18.54,11.94
SPID  (via drill 0.35)
  Top 0.203: v16.4,14.15 15.94,14.61 U7.35 | v14.47,14.01 14.03,13.57 U1.5
  Bottom 0.203: v16.4,14.15 16.28,14.03 14.49,14.03 v14.47,14.01
SPIHD
  Top 0.203: U7.30 13.94,14.49 13.74,14.29 13.37,14.29 12.93,13.85 12.93,12.42 13.38,11.97 U1.7
SPIQ
  Top 0.203: U1.2 17.16,11.97 16.96,12.18 16.96,12.63 15.54,14.05 U7.34
SPIWP  (via drill 0.35)
  Top 0.203: U7.31 v14.34,15.85 | U1.3 18.33,12.77 18.53,12.97 v18.53,13.02
  Bottom 0.203: v14.34,15.85 15.58,15.85 16.24,15.19 16.36,15.19 v18.53,13.02
USB_D+  (via drill 0.35)
  Top 0.203: R11.2 26.71,10.98 26.71,11.47 v26.84,11.6 | v32.79,12.41 33.62,12.41 36.04,14.83 36.04,21.33 37.08,22.37 39.98,22.37 40.57,22.96 41.54,22.96 42.43,22.08 42.43,21.02 U4.1
  Bottom 0.203: v26.84,11.6 27.12,11.32 31.7,11.32 v32.79,12.41 32.79,12.47 P6.P$1
USB_D-  (via drill 0.35)
  Top 0.203: v25.91,11.57 25.68,11.34 25.68,10.92 R10.2 | v32.79,11.5 33.3,11.5 36.41,14.61 36.41,17.46 38.78,19.83 40.65,19.83 41.41,20.59 U4.2
  Bottom 0.203: v32.79,11.5 32.79,11.25 32.5,10.96 26.52,10.96 v25.91,11.57 26.42,12.08 P5.P$1
VBUS  (via drill 0.35)
  Top 0.203: J2.A4 J2.B9 | J2.B9 23.89,7.93 | 28.67,7.93 J2.B4 J2.A9 28.68,8.22 | J2.B9 23.87,8.23
  Top 0.4: 28.68,8.22 28.68,8.98 28.97,9.27 30.65,9.27 31.82,8.1 31.82,6.31 C4.2 32.68,6.26 32.92,6.02 U6.4 33.05,6.02 33.8,6.77 35.61,6.77 | U4.7 39.41,14.59 39.1,14.28 C10.1 39.03,14.17 38.51,13.66 36.85,13.66 35.61,12.42 35.61,6.77 | D9.+ D2.+ 45.62,4.9 44.55,5.97 D10.+ 43.35,6.2 v43.19,6.36 | R34.2 24.58,13.79 23.87,13.08 23.87,8.23 | 35.61,6.77 37.01,6.77 v37.03,6.79
  Top 0.5: 23.89,7.93 23.89,7.14 24.8,6.24 27.77,6.24 28.67,7.14 28.67,7.93 | R34.2 25.93,13.81 R35.2
  Bottom 0.4: v43.19,6.36 42.76,6.79 42.18,6.79 | v37.03,6.79 42.18,6.79 | P4.P$1 42.19,6.78 42.18,6.79
VCOM
  Top 0.203: C28.1 29.17,12.38 29.17,11.7 29.99,10.88 29.99,10.41 30.25,10.15 U3.24
VDD
  Top 0.203: U3.18 30.24,13.16 29.99,13.41 29.99,14.8 29.52,15.26 29.52,15.45 C25.1
VDD_SPI
  Top 0.203: U7.29 12.25,13.69 C41.2
  Top 0.3: U1.8 13.13,11.17 C42.2
  Top 0.5: C41.2 C42.2
VDHR  (via drill 0.35)
  Top 0.203: C23.1 28.76,18.68 29.73,19.65 U3.5 32.01,19.65 v32.28,19.93
  Bottom 0.203: v32.28,19.93 32.2,19.84 28.61,19.84 P58.P$1
VIN  (via drill 0.35)
  Top 0.4: v45.82,15.63 45.9,15.63 46.71,14.83 D7.- 46.75,14.65 47.81,13.59 47.81,9.19 v47.63,9.01 v47.64,9 | U2.4 37.85,9.1 39.42,7.53 40.12,7.53 U2.1 41.58,7.66 41.79,7.88 C7.2 42.49,7.92 v42.83,7.58 42.83,7.18 42.25,6.61 U9.2 | v46.16,1.34 46.14,1.32 | 46.14,1.32 46.09,1.27 D3.- | D2.- 46.14,2 46.14,1.32
  Top 0.5: U8.2 46.83,9.01 v47.63,9.01
  Bottom 0.4: v45.82,15.63 45,14.82 45,7.92 44.35,7.26 43.14,7.26 v42.83,7.58 | v47.64,9 47.67,9 47.74,8.93 47.74,2.92 v46.16,1.34
VSH
  Top 0.203: U3.20 30.87,12.17 30.11,12.17 29.98,12.3 29.98,12.91 29.62,13.26 29.62,14.26 C26.1
VSL
  Top 0.203: U3.22 30.25,11.15 29.62,11.78 29.62,12.76 29.02,13.36 C27.1

### Text on the board
tPlace: ESP32 Display-1.54(E) inch | SKU:DIE09154S | V1.0 | Power in | GND | 5V | TXD | RXD | - | +